# Altium schematic sheet USB.SchDoc
size A3; SheetNumber: 4; SheetTotal: 4
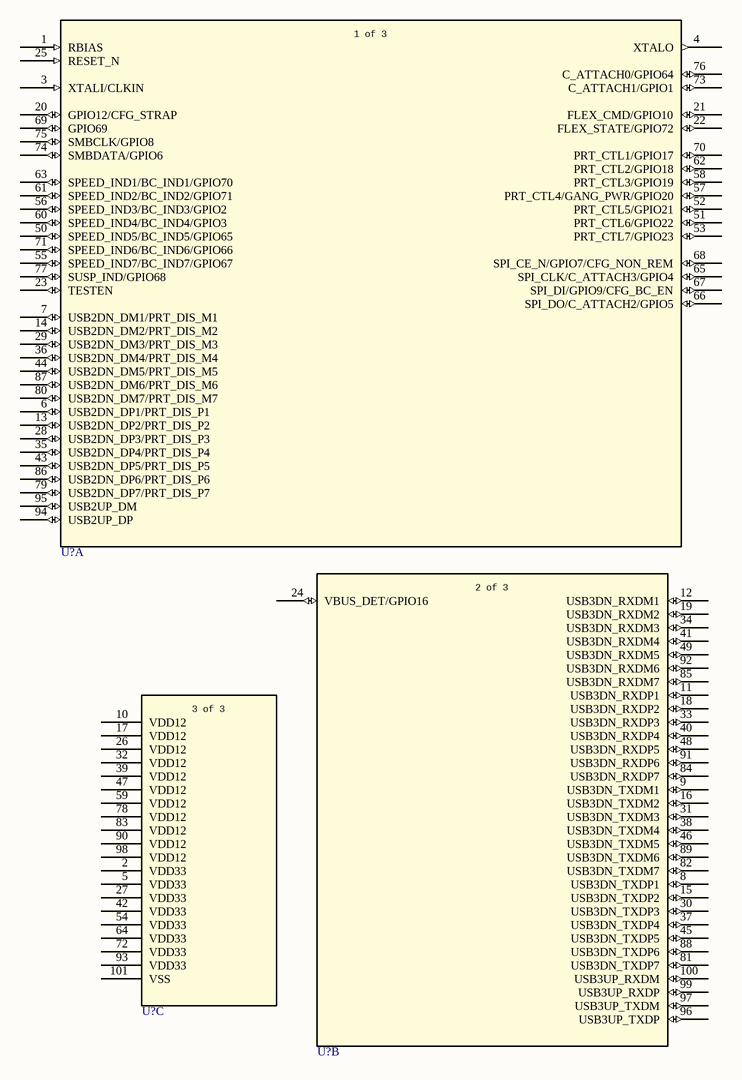
[diagram p0: USB.SchDoc]

## Parts
(Parts that share a designator on the sheet are numbered #1, #2 ... from top to bottom, then left to right.)
U?#1  USB5807C/KD  [VQFN100_KDX_MCH]  (value not drawn)  (part A of 3)
U?#2  USB5807C/KD  [VQFN100_KDX_MCH]  (value not drawn)  (part B of 3)
U?#3  USB5807C/KD  [VQFN100_KDX_MCH]  (value not drawn)  (part C of 3)

## Nets

Not connected (* = marked no-connect by the designer): U?#1 1(RBIAS) 3(XTALI/CLKIN) 4(XTALO) 6(USB2DN_DP1/PRT_DIS_P1) 7(USB2DN_DM1/PRT_DIS_M1) 13(USB2DN_DP2/PRT_DIS_P2) 14(USB2DN_DM2/PRT_DIS_M2) 20(GPIO12/CFG_STRAP) 21(FLEX_CMD/GPIO10) 22(FLEX_STATE/GPIO72) 23(TESTEN) 25(RESET_N) 28(USB2DN_DP3/PRT_DIS_P3) 29(USB2DN_DM3/PRT_DIS_M3) 35(USB2DN_DP4/PRT_DIS_P4) 36(USB2DN_DM4/PRT_DIS_M4) 43(USB2DN_DP5/PRT_DIS_P5) 44(USB2DN_DM5/PRT_DIS_M5) 50(SPEED_IND5/BC_IND5/GPIO65) 51(PRT_CTL6/GPIO22) 52(PRT_CTL5/GPIO21) 53(PRT_CTL7/GPIO23) 55(SPEED_IND7/BC_IND7/GPIO67) 56(SPEED_IND3/BC_IND3/GPIO2) 57(PRT_CTL4/GANG_PWR/GPIO20) 58(PRT_CTL3/GPIO19) 60(SPEED_IND4/BC_IND4/GPIO3) 61(SPEED_IND2/BC_IND2/GPIO71) 62(PRT_CTL2/GPIO18) 63(SPEED_IND1/BC_IND1/GPIO70) 65(SPI_CLK/C_ATTACH3/GPIO4) 66(SPI_DO/C_ATTACH2/GPIO5) 67(SPI_DI/GPIO9/CFG_BC_EN) 68(SPI_CE_N/GPIO7/CFG_NON_REM) 69(GPIO69) 70(PRT_CTL1/GPIO17) 71(SPEED_IND6/BC_IND6/GPIO66) 73(C_ATTACH1/GPIO1) 74(SMBDATA/GPIO6) 75(SMBCLK/GPIO8) 76(C_ATTACH0/GPIO64) 77(SUSP_IND/GPIO68) 79(USB2DN_DP7/PRT_DIS_P7) 80(USB2DN_DM7/PRT_DIS_M7) 86(USB2DN_DP6/PRT_DIS_P6) 87(USB2DN_DM6/PRT_DIS_M6) 94(USB2UP_DP) 95(USB2UP_DM); U?#2 8(USB3DN_TXDP1) 9(USB3DN_TXDM1) 11(USB3DN_RXDP1) 12(USB3DN_RXDM1) 15(USB3DN_TXDP2) 16(USB3DN_TXDM2) 18(USB3DN_RXDP2) 19(USB3DN_RXDM2) 24(VBUS_DET/GPIO16) 30(USB3DN_TXDP3) 31(USB3DN_TXDM3) 33(USB3DN_RXDP3) 34(USB3DN_RXDM3) 37(USB3DN_TXDP4) 38(USB3DN_TXDM4) 40(USB3DN_RXDP4) 41(USB3DN_RXDM4) 45(USB3DN_TXDP5) 46(USB3DN_TXDM5) 48(USB3DN_RXDP5) 49(USB3DN_RXDM5) 81(USB3DN_TXDP7) 82(USB3DN_TXDM7) 84(USB3DN_RXDP7) 85(USB3DN_RXDM7) 88(USB3DN_TXDP6) 89(USB3DN_TXDM6) 91(USB3DN_RXDP6) 92(USB3DN_RXDM6) 96(USB3UP_TXDP) 97(USB3UP_TXDM) 99(USB3UP_RXDP) 100(USB3UP_RXDM); U?#3 2(VDD33) 5(VDD33) 10(VDD12) 17(VDD12) 26(VDD12) 27(VDD33) 32(VDD12) 39(VDD12) 42(VDD33) 47(VDD12) 54(VDD33) 59(VDD12) 64(VDD33) 72(VDD33) 78(VDD12) 83(VDD12) 90(VDD12) 93(VDD33) 98(VDD12) 101(VSS)

## Notes on the sheet
- (in symbol USB5807CKD, part A) 1 of 3
- (in symbol USB5807CKD, part B) 2 of 3
- (in symbol USB5807CKD, part C) 3 of 3

## Library data of the parts
U?#1-U?#3 = USB5807CKD: IC USB HUB CNTRL I2C/SPI 100VQFN 7port USB 3.2 hub; Manufacturer_Name: Microchip; Copyright: Copyright (C) 2026 Ultra Librarian. All rights reserved.; Manufacturer_Part_Number: USB5807C/KD; RefDes: RefDes; Type: Type; ComponentLink1Description: Digikey; ComponentLink1URL: https://www.digikey.com/en/products/detail/microchip-technology/USB5807C-KD/10231377